# EAGLE design 519_jetson_nano_107 (EAGLE 9.6.0)
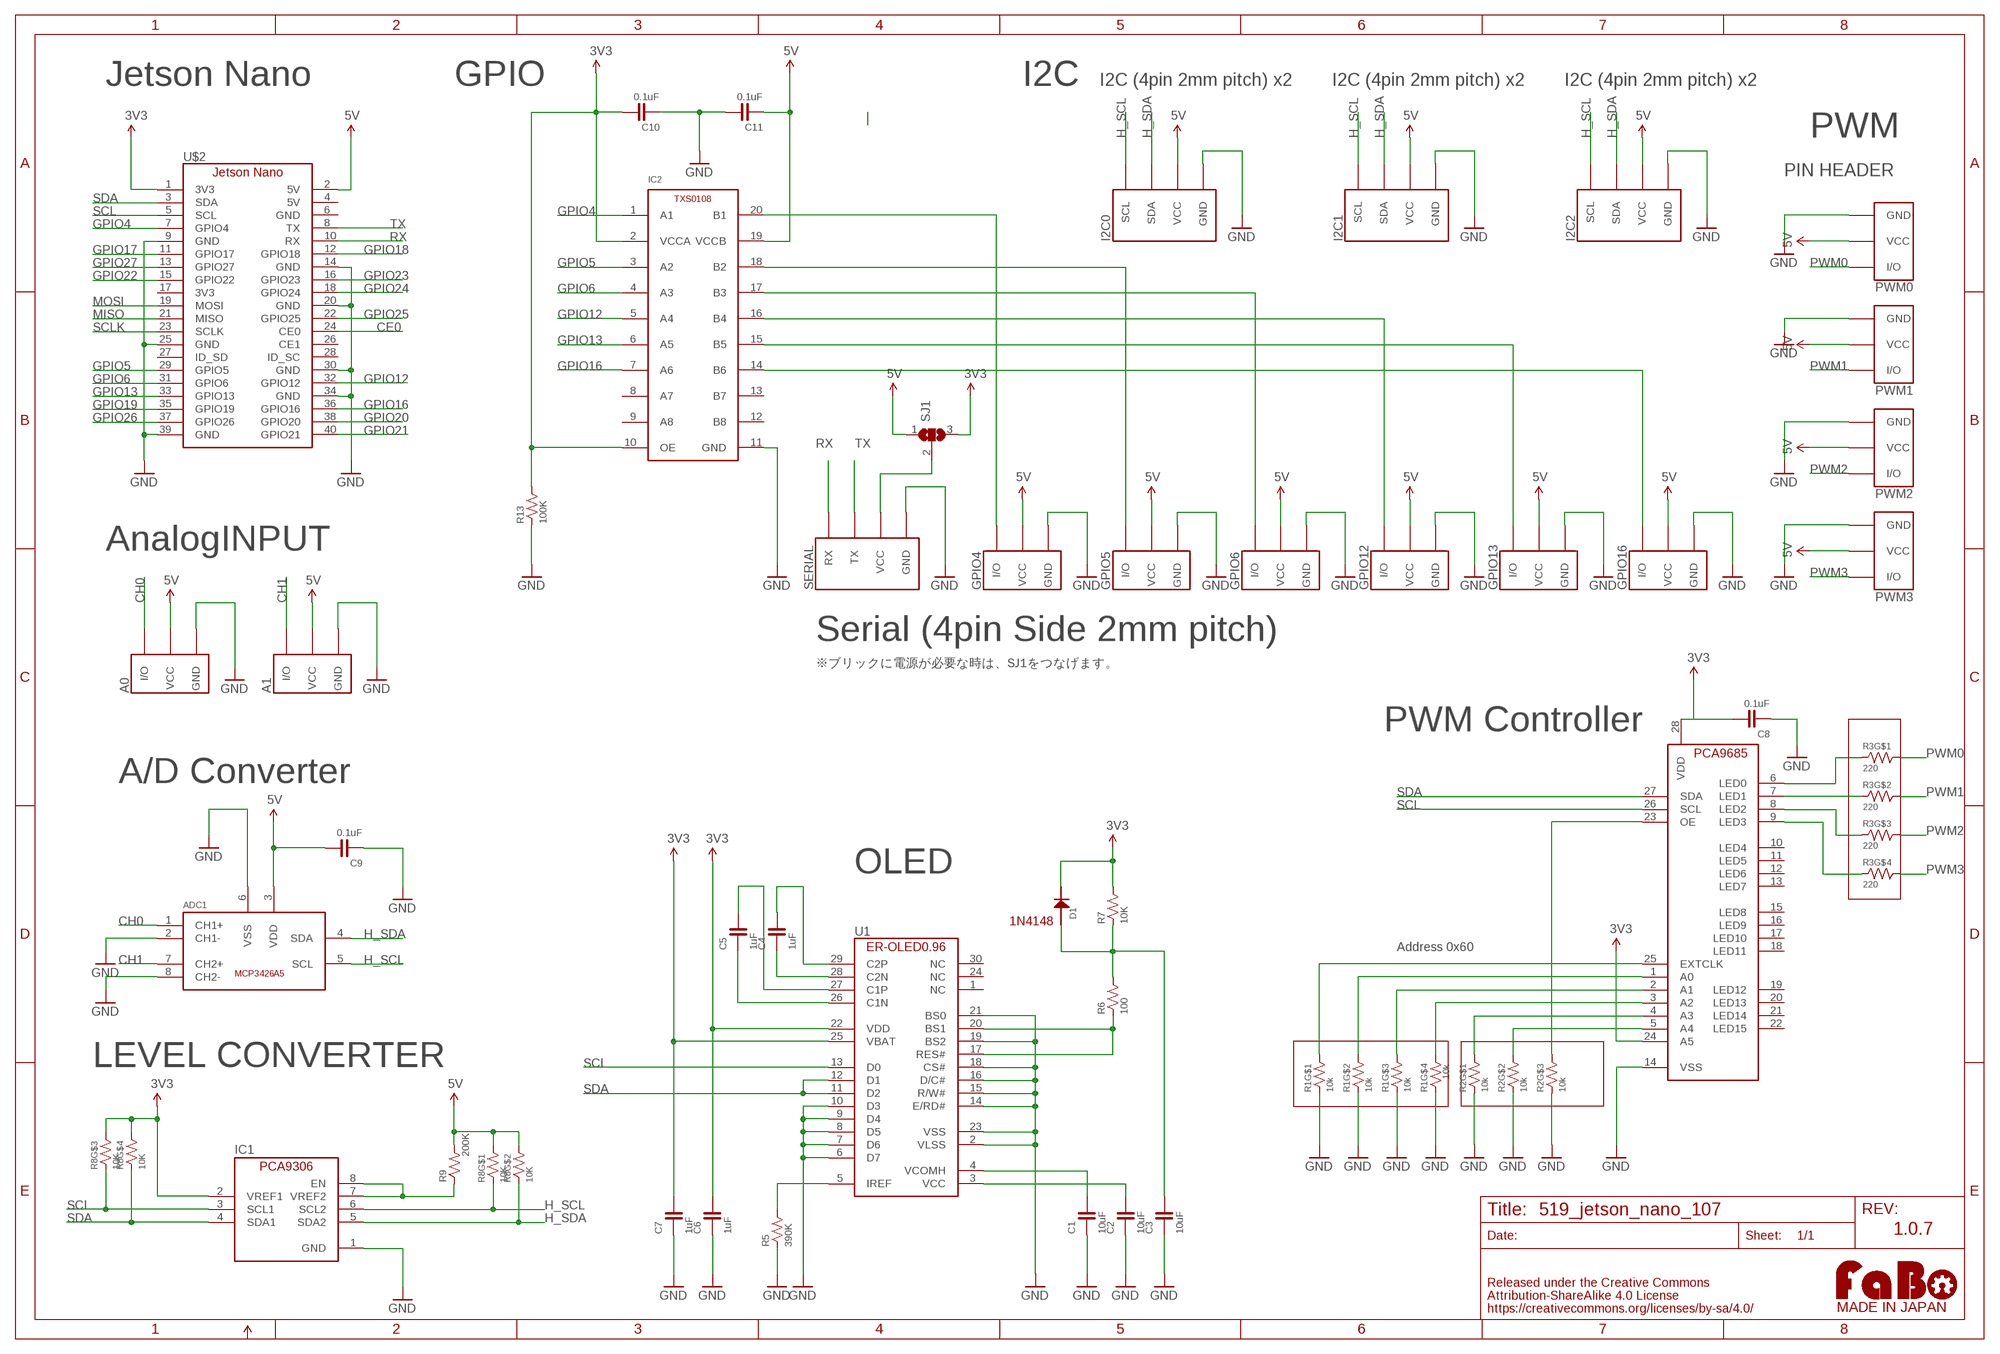
[diagram p0: schematic, sheet 1]

## Parts
A0  FABO_BRICK_3PIN-S03B-PASK-2  [FABO_BRICK_3PIN_S03B-PASK-2]
A1  FABO_BRICK_3PIN-S03B-PASK-2  [FABO_BRICK_3PIN_S03B-PASK-2]
ADC1  MICROCHIP-MCP3426  [MICROCHIP-MCP3426]
C1  10uF  CAPACITOR-0603-BOTTOM  [0603-BOTTOM]
C2  10uF  CAPACITOR-0603-BOTTOM  [0603-BOTTOM]
C3  10uF  CAPACITOR-0603-BOTTOM  [0603-BOTTOM]
C4  1uF  CAPACITOR-0603-BOTTOM  [0603-BOTTOM]
C5  1uF  CAPACITOR-0603-BOTTOM  [0603-BOTTOM]
C6  1uF  CAPACITOR-0603-BOTTOM  [0603-BOTTOM]
C7  1uF  CAPACITOR-0603-BOTTOM  [0603-BOTTOM]
C8  0.1uF  CAPACITOR-0603  [0603]
C9  0.1uF  CAPACITOR-0603  [0603]
C10  0.1uF  CAPACITOR-0603  [0603]
C11  0.1uF  CAPACITOR-0603  [0603]
D1  1N4148  [1N4148W]
GPIO4  FABO_BRICK_3PIN-B03B-PASK-1  [FABO_BRICK_3PIN_B03B-PASK-1]
GPIO5  FABO_BRICK_3PIN-B03B-PASK-1  [FABO_BRICK_3PIN_B03B-PASK-1]
GPIO6  FABO_BRICK_3PIN-B03B-PASK-1  [FABO_BRICK_3PIN_B03B-PASK-1]
GPIO12  FABO_BRICK_3PIN-B03B-PASK-1  [FABO_BRICK_3PIN_B03B-PASK-1]
GPIO13  FABO_BRICK_3PIN-B03B-PASK-1  [FABO_BRICK_3PIN_B03B-PASK-1]
GPIO16  FABO_BRICK_3PIN-B03B-PASK-1  [FABO_BRICK_3PIN_B03B-PASK-1]
I2C0  FABO_BRICK_I2C-S04B-PASK-2  [FABO_BRICK_I2C_S04B-PASK-2]
I2C1  FABO_BRICK_I2C-B04B-PASK-1  [FABO_BRICK_I2C_B04B-PASK-1]
I2C2  FABO_BRICK_I2C-B04B-PASK-1  [FABO_BRICK_I2C_B04B-PASK-1]
IC1  PCA9306_SSOP  [8PIN-SSOP]
IC2  TXS0108  [R-PUSON-N20]
PWM0  FABO_BRICK_3PIN-HEADER  [FABO_BRICK_3PIN_HEADER]
PWM1  FABO_BRICK_3PIN-HEADER  [FABO_BRICK_3PIN_HEADER]
PWM2  FABO_BRICK_3PIN-HEADER  [FABO_BRICK_3PIN_HEADER]
PWM3  FABO_BRICK_3PIN-HEADER  [FABO_BRICK_3PIN_HEADER]
R1  10k  RESISTOR_ARRAY  [EXBV8V]
R2  10k  RESISTOR_ARRAY  [EXBV8V]
R3  220  RESISTOR_ARRAY  [EXBV8V]
R5  390K  RESISTOR-0603-BOTTOM  [0603-BOTTOM]
R6  100  RESISTOR-0603-BOTTOM  [0603-BOTTOM]
R7  10K  RESISTOR-0603-BOTTOM  [0603-BOTTOM]
R8  10K  RESISTOR_ARRAY  [EXBV8V]
R9  200K  RESISTOR-0603  [0603]
R13  100K  RESISTOR-0603-BOTTOM  [0603-BOTTOM]
SERIAL  FABO_BRICK_SERIAL-B04B-PASK-1  [FABO_BRICK_SERIAL_B04B-PASK-1]
SJ1  SJ2W  [SJ_2]
U1  ER-OLED0.96-1ER-CON30HT-1  [ER-CON30HT-1]
U$2  JETSON_NANO_WIDE  [JETSON_NANO_WIDE]
U$9  PCA9685  [PCA9685]
U$14  LOGO_FABO-M  [LOGO_FABO_MS]

## Nets
3V3: C6.2 C7.2 C8.2 C10.2 D1.CATHODE IC1.2(VREF1) IC2.2(VCCA) IC2.10(OE) R7.2 R8.5 R8.6 R13.2 SJ1.3 U1.22(VDD) U1.25(VBAT) U$2.1(3V3) U$9.24(A5) U$9.28(VDD)
5V: A0.VCC A1.VCC ADC1.3(VDD) C9.2 C11.1 GPIO4.VCC GPIO5.VCC GPIO6.VCC GPIO12.VCC GPIO13.VCC GPIO16.VCC I2C0.VCC I2C1.VCC I2C2.VCC IC2.19(VCCB) PWM0.VCC PWM1.VCC PWM2.VCC PWM3.VCC R8.7 R8.8 R9.2 SJ1.1 U$2.2(5V)
CE0: U$2.24(CE0)
CH0: A0.I/O ADC1.1(CH1+)
CH1: A1.I/O ADC1.7(CH2+)
GND: A0.GND A1.GND ADC1.2(CH1-) ADC1.6(VSS) ADC1.8(CH2-) C1.1 C2.1 C3.1 C6.1 C7.1 C8.1 C9.1 C10.1 C11.2 GPIO4.GND GPIO5.GND GPIO6.GND GPIO12.GND GPIO13.GND GPIO16.GND I2C0.GND I2C1.GND I2C2.GND IC1.1(GND) IC2.11(GND) PWM0.GND PWM1.GND PWM2.GND PWM3.GND R1.1 R1.2 R1.3 R1.4 R2.1 R2.2 R2.3 R5.1 R13.1 SERIAL.GND U1.2(VLSS) U1.6(D7) U1.7(D6) U1.8(D5) U1.9(D4) U1.10(D3) U1.14(E/RD#) U1.15(R/W#) U1.16(D/C#) U1.18(CS#) U1.19(BS2) U1.21(BS0) U1.23(VSS) U$2.9(GND) U$2.14(GND) U$2.20(GND) U$2.25(GND) U$2.30(GND) U$2.34(GND) U$2.39(GND) U$9.14(VSS)
GPIO4: IC2.1(A1) U$2.7(GPIO4)
GPIO5: IC2.3(A2) U$2.29(GPIO5)
GPIO6: IC2.4(A3) U$2.31(GPIO6)
GPIO12: IC2.5(A4) U$2.32(GPIO12)
GPIO13: IC2.6(A5) U$2.33(GPIO13)
GPIO16: IC2.7(A6) U$2.36(GPIO16)
GPIO17: U$2.11(GPIO17)
GPIO18: U$2.12(GPIO18)
GPIO19: U$2.35(GPIO19)
GPIO20: U$2.38(GPIO20)
GPIO21: U$2.40(GPIO21)
GPIO22: U$2.15(GPIO22)
GPIO23: U$2.16(GPIO23)
GPIO24: U$2.18(GPIO24)
GPIO25: U$2.22(GPIO25)
GPIO26: U$2.37(GPIO26)
GPIO27: U$2.13(GPIO27)
H_SCL: ADC1.5(SCL) I2C0.SCL I2C1.SCL I2C2.SCL IC1.6(SCL2) R8.1
H_SDA: ADC1.4(SDA) I2C0.SDA I2C1.SDA I2C2.SDA IC1.5(SDA2) R8.2
MISO: U$2.21(MISO)
MOSI: U$2.19(MOSI)
N$2: R3.1 U$9.6(LED0)
N$3: R3.2 U$9.7(LED1)
N$4: R1.7 U$9.1(A0)
N$5: R3.3 U$9.8(LED2)
N$6: R3.4 U$9.9(LED3)
N$7: R2.6 U$9.23(OE)
N$8: R1.8 U$9.25(EXTCLK)
N$9: GPIO4.I/O IC2.20(B1)
N$10: R1.6 U$9.2(A1)
N$11: R1.5 U$9.3(A2)
N$12: R2.8 U$9.4(A3)
N$13: R2.7 U$9.5(A4)
N$14: C5.2 U1.27(C1P)
N$15: GPIO5.I/O IC2.18(B2)
N$16: C5.1 U1.26(C1N)
N$17: GPIO6.I/O IC2.17(B3)
N$18: GPIO12.I/O IC2.16(B4)
N$19: C4.1 U1.28(C2N)
N$20: GPIO13.I/O IC2.15(B5)
N$21: C4.2 U1.29(C2P)
N$22: GPIO16.I/O IC2.14(B6)
N$23: R5.2 U1.5(IREF)
N$24: C1.2 U1.4(VCOMH)
N$25: C2.2 U1.3(VCC)
N$26: R6.1 U1.17(RES#) U1.20(BS1)
N$27: C3.2 D1.ANODE R6.2 R7.1
N$30: SERIAL.VCC SJ1.2
N$33: IC1.7(VREF2) IC1.8(EN) R9.1
PWM0: PWM0.I/O R3.8
PWM1: PWM1.I/O R3.7
PWM2: PWM2.I/O R3.6
PWM3: PWM3.I/O R3.5
RX: SERIAL.RX U$2.10(RX)
SCL: IC1.3(SCL1) R8.3 U1.13(D0) U$2.5(SCL) U$9.26(SCL)
SCLK: U$2.23(SCLK)
SDA: IC1.4(SDA1) R8.4 U1.11(D2) U1.12(D1) U$2.3(SDA) U$9.27(SDA)
TX: SERIAL.TX U$2.8(TX)
Unconnected: IC2.8(A7) IC2.9(A8) IC2.12(B8) IC2.13(B7) R2.4 R2.5 U1.1(NC) U1.24(NC) U1.30(NC) U$2.4(5V) U$2.6(GND) U$2.17(3V3) U$2.26(CE1) U$2.27(ID_SD) U$2.28(ID_SC) U$9.10(LED4) U$9.11(LED5) U$9.12(LED6) U$9.13(LED7) U$9.15(LED8) U$9.16(LED9) U$9.17(LED10) U$9.18(LED11) U$9.19(LED12) U$9.20(LED13) U$9.21(LED14) U$9.22(LED15)

## Notes on the sheet
- Jetson Nano | GPIO | I2C | I2C (4pin 2mm pitch) x2 | I2C (4pin 2mm pitch) x2 | I2C (4pin 2mm pitch) x2
- PWM
- PIN HEADER
- AnalogINPUT
- Serial (4pin Side 2mm pitch)
- ※ブリックに電源が必要な時は、SJ1をつなげます。
- PWM Controller
- A/D Converter
- OLED
- 1N4148
- Address 0x60
- A5
- LEVEL CONVERTER
- 1.0.7

## Library data of the parts
A0 A1 GPIO4-GPIO6 GPIO12 GPIO13 GPIO16 PWM0 PWM1-PWM3 = FaBo-Template:FABO_BRICK_3PIN: FaBo Brick 3pin
ADC1 = FaBo-ADC:MICROCHIP-MCP3426
C1-C11 = FaBo-Capacitor:CAPACITOR: CAPACITOR
D1 = FaBo-Diode:1N4148
I2C0 I2C1 I2C2 = FaBo-Template:FABO_BRICK_I2C: FaBo Brick I2C
IC1 = FaBo-LevelTranslator:PCA9306
IC2 = FaBo-LevelTranslator:TXS0108
R1-R3 R8 = component:RESISTOR_ARRAY
R5-R7 R9 R13 = FaBo-Resistors:RESISTOR: RESISTOR
SERIAL = FaBo-Template:FABO_BRICK_SERIAL: FaBo Brick Serial
SJ1 = jumper:SJ2W: SMD solder JUMPER
U1 = FaBo-Display:ER-OLED0.96-1
U$2 = FaBo-Boards:JETSON_NANO
U$9 = FaBo-Motor:PCA9685
U$14 = FaBo-etc:LOGO_FABO

## Board
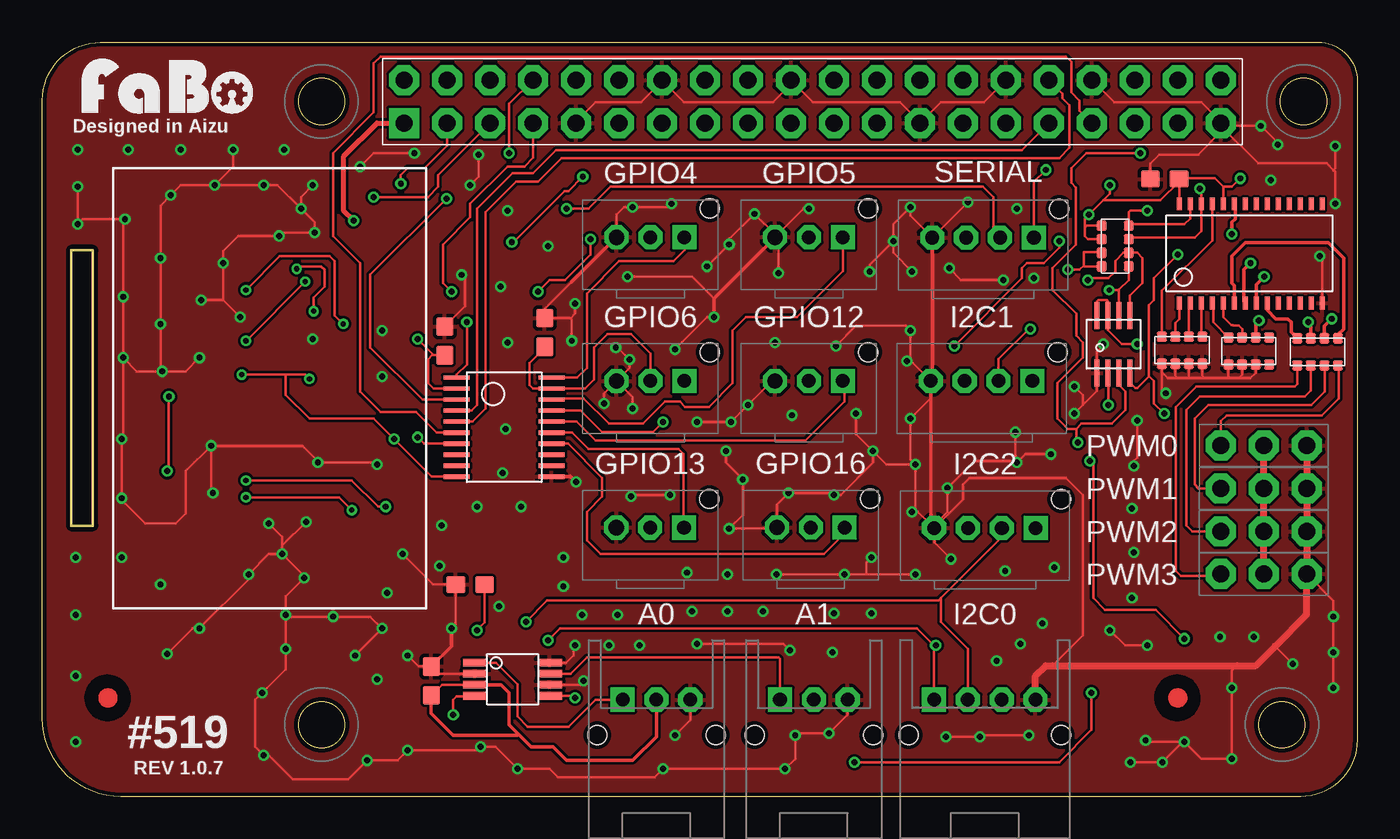
[diagram p1: board, top side]
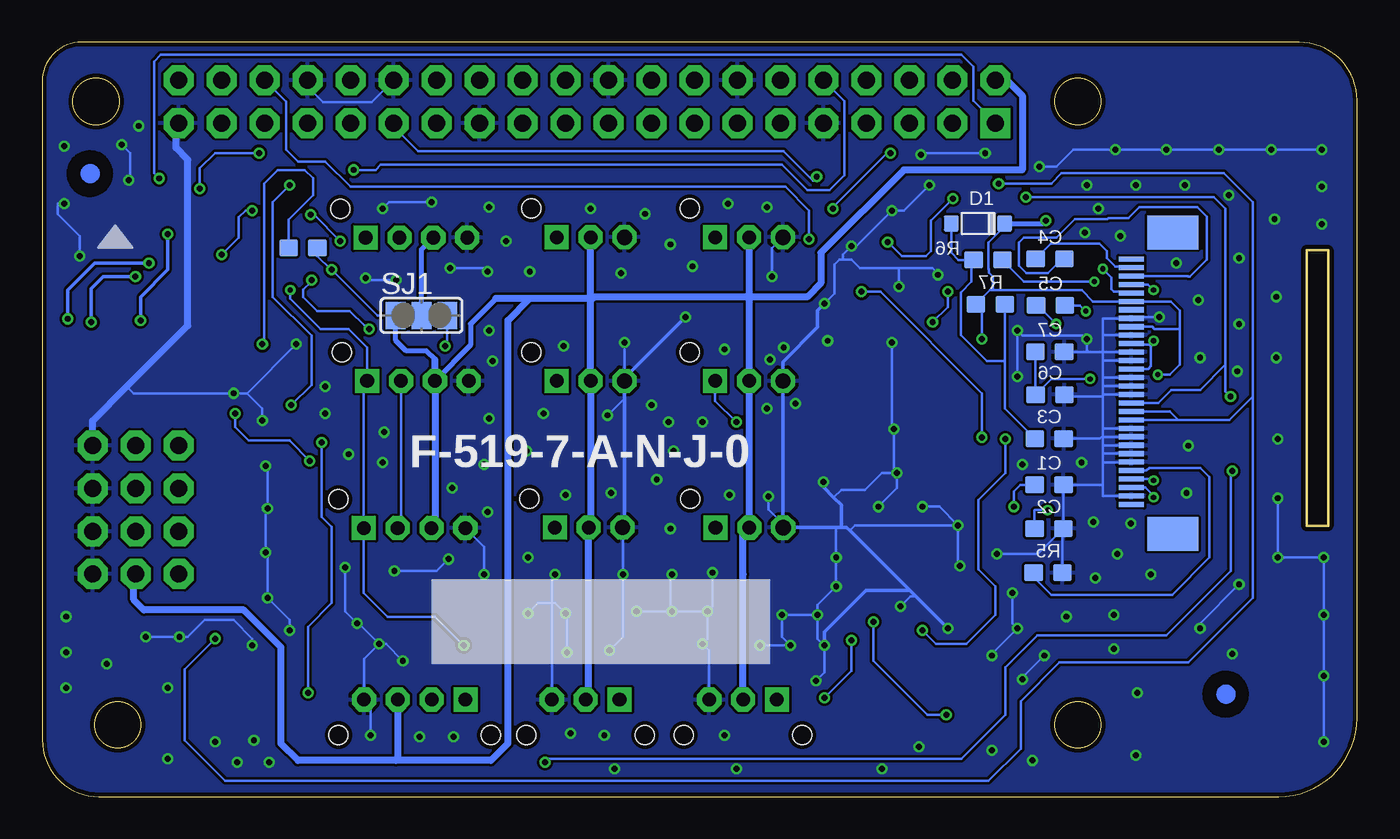
[diagram p2: board, bottom side, seen from below]

Size 74.16 x 39.58 mm. Coordinates in mm from the lower left corner, seen from the top.
Outline: 0,29.42 0,13.13 1.27,13.13 1.27,29.42 0,29.42
Outline: circle at 14.78,38.2 radius 1.38
Outline: circle at 14.78,1.38 radius 1.38
Outline: circle at 71.51,1.38 radius 1.38
Outline: circle at 72.78,38.2 radius 1.38
Copper layers (1*16): Top 0.035mm / dielectric 1.6mm / Bottom 0.035mm
Design rules "PCBway": minimum track width 6mil, minimum drill 12mil, track to track 6mil, track to pad 6mil, pad to pad 6mil, via to via 6mil, smd to smd 6mil, copper to edge 10mil, drill to drill 10mil, minimum pad ring 10mil, minimum via ring 6mil, stop-mask expansion 2mil, vias tented up to drill 100mil, thermal gap 8mil
bRestrict: 7 lines

### Footprints (pad centres in the part's own frame; a part is rotated, then mirrored left to right if it is on the bottom)
FABO_BRICK_3PIN_S03B-PASK-2 = drill 0.8 pad 1.422 octagon: GND -2,0; VCC 0,0 | drill 0.8 pad 1.422 square: I/O 2,0 | hole 1.1: 3.5,2.1; -3.5,2.1
MICROCHIP-MCP3426 = smd 0.45 x 1.45: 1 -0.975,-2.2; 2 -0.325,-2.2; 3 0.325,-2.2; 4 0.975,-2.2; 5 0.975,2.2; 6 0.325,2.2; 7 -0.325,2.2; 8 -0.975,2.2
0603-BOTTOM = smd 1.1 x 1 bottom: 1 -0.85,0; 2 0.85,0
0603 = smd 1.1 x 1: 1 -0.85,0; 2 0.85,0
1N4148W = smd 0.9 x 0.95: ANODE 0,0; CATHODE 3.15,0
FABO_BRICK_3PIN_B03B-PASK-1 = drill 0.9 pad 1.422 octagon: GND -2,0 | drill 0.8 pad 1.422 square: I/O 2,0 | drill 0.8 pad 1.422 octagon: VCC 0,0 | hole 1.1: 3.5,1.7
FABO_BRICK_I2C_S04B-PASK-2 = drill 0.8 pad 1.422 octagon: GND -3,0; SDA 1,0; VCC -1,0 | drill 0.8 pad 1.422 square: SCL 3,0 | hole 1.1: 4.5,2.1; -4.5,2.1
FABO_BRICK_I2C_B04B-PASK-1 = drill 0.8 pad 1.422 octagon: GND -3,0; SDA 1,0; VCC -1,0 | drill 0.8 pad 1.422 square: SCL 3,0 | hole 1.1: 4.5,1.7
8PIN-SSOP = smd 0.3 x 1.6: 1 -0.975,-1.7; 2 -0.325,-1.7; 3 0.325,-1.7; 4 0.975,-1.7; 5 0.975,1.7; 6 0.325,1.7; 7 -0.325,1.7; 8 -0.975,1.7
R-PUSON-N20 = smd 0.25 x 1.55: 1 -2.925,-2.8; 2 -2.275,-2.8; 3 -1.625,-2.8; 4 -0.975,-2.8; 5 -0.325,-2.8; 6 0.325,-2.8; 7 0.975,-2.8; 8 1.625,-2.8; 9 2.275,-2.8; 10 2.925,-2.8; 11 2.925,2.8; 12 2.275,2.8; 13 1.625,2.8; 14 0.975,2.8; 15 0.325,2.8; 16 -0.325,2.8; 17 -0.975,2.8; 18 -1.625,2.8; 19 -2.275,2.8; 20 -2.925,2.8
FABO_BRICK_3PIN_HEADER = drill 1 pad 1.778 octagon: GND -2.54,0; I/O 2.54,0; VCC 0,0
EXBV8V = smd 0.6 x 0.6: 1 -1.2,-0.8; 2 -0.4,-0.8; 3 0.4,-0.8; 4 1.2,-0.8; 5 1.2,0.8; 6 0.4,0.8; 7 -0.4,0.8; 8 -1.2,0.8
FABO_BRICK_SERIAL_B04B-PASK-1 = drill 0.8 pad 1.422 octagon: GND -3,0; TX 1,0; VCC -1,0 | drill 0.8 pad 1.422 square: RX 3,0 | hole 1.1: 4.5,1.7
SJ_2 = smd 1.168 x 1.6: 1 -1.524,0; 2 0,0; 3 1.524,0
ER-CON30HT-1 = smd 0.3 x 1.5 bottom: 1 7,-0.23; 2 6.5,-0.23; 3 6,-0.23; 4 5.5,-0.23; 5 5,-0.23; 6 4.5,-0.23; 7 4,-0.23; 8 3.5,-0.23; 9 3,-0.23; 10 2.5,-0.23; 11 2,-0.23; 12 1.5,-0.23; 13 1,-0.23; 14 0.5,-0.23; 15 0,-0.23; 16 -0.5,-0.23; 17 -1,-0.23; 18 -1.5,-0.23; 19 -2,-0.23; 20 -2.5,-0.23; 21 -3,-0.23; 22 -3.5,-0.23; 23 -4,-0.23; 24 -4.5,-0.23; 25 -5,-0.23; 26 -5.5,-0.23; 27 -6,-0.23; 28 -6.5,-0.23; 29 -7,-0.23; 30 -7.5,-0.23 | smd 2 x 3 bottom: 31 -9.07,-2.67; 32 8.74,-2.67
JETSON_NANO_WIDE = drill 1 pad 1.778 square: 1 21.59,39.37 | drill 1 pad 1.778 octagon: 2 21.59,41.91; 3 24.13,39.37; 4 24.13,41.91; 5 26.67,39.37; 6 26.67,41.91; 7 29.21,39.37; 8 29.21,41.91; 9 31.75,39.37; 10 31.75,41.91; 11 34.29,39.37; 12 34.29,41.91; 13 36.83,39.37; 14 36.83,41.91; 15 39.37,39.37; 16 39.37,41.91; 17 41.91,39.37; 18 41.91,41.91; 19 44.45,39.37; 20 44.45,41.91; 21 46.99,39.37; 22 46.99,41.91; 23 49.53,39.37; 24 49.53,41.91; 25 52.07,39.37; 26 52.07,41.91; 27 54.61,39.37; 28 54.61,41.91; 29 57.15,39.37; 30 57.15,41.91; 31 59.69,39.37; 32 59.69,41.91; 33 62.23,39.37; 34 62.23,41.91; 35 64.77,39.37; 36 64.77,41.91; 37 67.31,39.37; 38 67.31,41.91; 39 69.85,39.37; 40 69.85,41.91
PCA9685 = smd 0.3 x 0.75: 1 -4.15,-2.93; 2 -3.5,-2.93; 3 -2.85,-2.93; 4 -2.2,-2.93; 5 -1.55,-2.93; 6 -0.9,-2.93; 7 -0.25,-2.93; 8 0.4,-2.93; 9 1.05,-2.93; 10 1.7,-2.93; 11 2.35,-2.93; 12 3,-2.93; 13 3.65,-2.93; 14 4.3,-2.93; 15 4.3,2.92; 16 3.65,2.92; 17 3,2.92; 18 2.35,2.92; 19 1.7,2.92; 20 1.05,2.92; 21 0.4,2.92; 22 -0.25,2.92; 23 -0.9,2.92; 24 -1.55,2.92; 25 -2.2,2.92; 26 -2.85,2.92; 27 -3.5,2.92; 28 -4.15,2.92

### Placement (x,y rotation side)
A0  34.56,2.86 180 top
A1  43.86,2.86 180 top
ADC1  26.06,4.06 270 top
C1  16.48,15.55 0 top
C2  16.49,12.97 0 top
C3  16.47,18.29 0 top
C4  16.43,28.91 0 top
C5  16.4,26.16 0 top
C6  16.43,20.89 0 top
C7  16.44,23.42 0 top
C8  64.59,33.63 0 top
C9  21.26,3.97 270 top
C10  22.06,24.07 270 top
C11  27.96,24.57 90 top
D1  22.26,31 0 bottom
GPIO4  34.21,30.18 0 top
GPIO5  43.57,30.18 0 top
GPIO6  34.21,21.7 0 top
GPIO12  43.57,21.7 0 top
GPIO13  34.19,13.03 0 top
GPIO16  43.68,13.04 0 top
I2C0  53.96,2.86 180 top
I2C1  53.77,21.7 0 top
I2C2  53.97,13 0 top
IC1  61.56,23.87 0 top
IC2  25.56,18.96 270 top
PWM0  70.45,17.89 180 top
PWM1  70.44,15.35 180 top
PWM2  70.44,12.8 180 top
PWM3  70.44,10.29 180 top
R1  65.62,23.51 0 top
R2  69.56,23.46 0 top
R3  73.62,23.42 180 top
R5  16.54,10.35 0 top
R6  20.09,28.85 0 top
R7  19.95,26.24 0 top
R8  61.66,29.67 90 top
R9  60.56,29.57 0 bottom
R13  23.56,9.66 180 bottom
SERIAL  53.86,30.17 0 top
SJ1  53.56,25.57 0 bottom
U1  11.85,21.39 270 top
U$2  -1.94,-2.44 0 top
U$3  [MARK_POINT_3MM]  2.16,2.97 0 top
U$4  [MARK_POINT_3MM]  65.36,2.97 0 top
U$5  [MARK_POINT_3MM]  6.03,3.19 0 bottom
U$6  [MARK_POINT_3MM]  73.13,33.95 0 bottom
U$9  69.59,29.23 0 top
U$14  5.68,37.12 0 top

### Tracks (layer width: path | path; a pad name or v marks a point on that pad's centre or on a via)
3V3  (via drill 0.3, 0.35)
  Top 0.152: v14.06,21.82 13.81,22.07 12.66,22.07 | v10.06,22.07 12.66,22.07 | R8.6 60.06,30.07 59.86,30.27 59.86,30.77 | 59.86,30.77 59.96,30.86 R8.5 | 59.86,30.77 59.86,31.27 v60.11,31.52 60.96,32.36 | U$9.28 65.44,33.46 | 65.44,33.46 C8.2 | C8.2 | U$9.24 68.04,33.16 | 68.04,33.16 68.04,33.18 67.56,33.66 65.49,33.66 C8.2 | 65.44,33.46 64.34,32.36 60.96,32.36 | IC1.2 61.26,22.14 v61.26,20.27 | v61.36,33.27 61.36,32.77 60.96,32.36 | v69.06,33.66 68.56,33.16 68.04,33.16 | v20.46,24.17 21.41,23.21 C10.2 21.31,23.21 21.06,22.96 21.06,21.57 21.38,21.24 IC2.2 | R13.2 24.41,7.41 v23.96,6.96 | 12.66,22.07 12.66,20.87 14.06,19.46 17.86,19.46 v19.06,18.27 21.29,16.04 IC2.10 | v52.16,23.77 56.16,27.77 56.16,28.37 56.46,28.67 57.46,28.67 58.36,29.57 v58.36,29.96
  Top 0.305: v16.66,31.17 16.06,31.77 16.06,34.95 18.05,36.93 U$2.1
  Bottom 0.152: 19.81,27.07 14.56,27.07 13.89,26.39 U1.25 9.29,26.39 8.76,25.87 8.76,24.77 | 19.81,27.07 19.81,27.87 20.04,28.09 20.04,28.29 20.06,28.32 20.06,29.86 19.11,30.82 D1.CATHODE | v61.26,20.27 60.06,21.46 60.06,24.37 62.36,26.67 62.36,32.27 v61.36,33.27 | v69.06,33.66 69.36,33.96 69.36,40.56 68.96,40.96 21.66,40.96 20.96,40.27 20.96,38.24 U$2.1 | v10.06,22.07 9.36,22.07 8.76,22.67 8.76,24.77 | 19.81,27.07 19.97,27.07 R7.2 20.46,25.89 v20.46,24.17 | U1.22 10.39,24.89 10.26,24.77 8.76,24.77 | C7.2 C6.2 16.35,21.82 v14.06,21.82 | v23.96,6.96 23.16,6.16 21.36,6.16 19.66,7.87 19.66,9.56 20.66,10.56 20.66,14.67 19.06,16.27 v19.06,18.27 | SJ1.3 52.04,23.89 v52.16,23.77 | v58.36,29.96 59.91,31.52 v60.11,31.52
  Bottom 0.305: D1.CATHODE 16.83,31 v16.66,31.17
5V  (via drill 0.35)
  Top 0.152: R8.7 60.86,29.32 59.81,29.32 59.81,28.52 | ADC1.3 21.88,3.74 C9.2 | R8.8 59.86,28.46 59.81,28.52 | v58.86,28.27 59.56,28.27 59.81,28.52 | C11.1 27.96,23.67 27.06,22.77 27.06,21.46 27.29,21.24 IC2.19 30.33,21.24 30.86,21.77 30.86,23.67 31.66,24.46 33.06,24.46 34.21,23.32 GPIO6.VCC
  Top 0.2: ADC1.3 25.38,3.74 25.86,3.27 25.86,1.36 26.41,0.81 | 26.41,0.81 27.16,0.06 28.46,0.06 29.26,-0.74 33.16,-0.74 34.56,0.67 A0.VCC | C9.2 21.26,2.06 22.56,0.77 26.36,0.77 26.41,0.81
  Top 0.406: PWM3.VCC PWM2.VCC PWM1.VCC PWM0.VCC
  Bottom 0.152: R9.2 59.71,29.07 58.91,28.27 v58.86,28.27 56.16,25.57 SJ1.1 | 34.46,10.37 34.56,10.26
  Bottom 0.305: 49.16,26.57 50.66,25.07 50.66,23.8 I2C1.VCC | 52.77,22.96 53.28,23.46 54.46,23.46 55.08,24.09 SJ1.1
  Bottom 0.406: 55.06,-0.74 49.46,-0.74 48.45,0.27 48.45,25.27 47.16,26.57 | 55.06,-0.74 60.86,-0.74 61.86,0.27 61.86,5.96 64.06,8.16 69.96,8.16 70.56,8.76 70.56,10.16 PWM3.VCC | I2C0.VCC 54.96,-0.64 55.06,-0.74 | A1.VCC 43.68,3.05 GPIO16.VCC 43.57,13.14 GPIO12.VCC 43.57,26.46 | A0.VCC 34.56,10.26 34.56,12.65 GPIO13.VCC 34.19,21.68 GPIO6.VCC 34.21,26.67 | 52.77,22.96 I2C1.VCC 52.77,13.21 I2C2.VCC | GPIO4.VCC 34.21,26.67 | 34.21,26.67 30.76,26.67 29.96,27.46 29.96,29.27 25.06,34.16 18.06,34.16 18.06,38.56 18.97,39.47 U$2.2 | 43.57,26.46 43.57,26.57 | 43.57,26.57 GPIO5.VCC | 34.21,26.67 43.37,26.67 43.57,26.46 | 43.57,26.57 47.16,26.57 | 47.16,26.57 49.16,26.57
CH0
  Top 0.152: ADC1.1 25.08,5.04 26.36,3.77 26.36,1.86 26.96,1.27 29.36,1.27 30.96,2.86 A0.I/O
CH1
  Top 0.152: ADC1.7 29.48,4.39 30.46,5.37 41.76,5.37 41.86,5.27 A1.I/O
GND  (via drill 0.35)
  Top 0.152: ADC1.2 21.68,4.39 C9.1 20.51,4.81 v19.86,5.46 | ADC1.6 30.04,3.74 v30.26,3.97 | v29.76,6.06 29.66,5.96 29.66,5.46 29.23,5.04 ADC1.8 | R2.1 68.36,21.96 68.46,21.87 | 68.46,21.87 68.96,21.87 | 68.96,21.87 69.16,22.07 R2.2 | R2.3 69.96,22.17 69.66,21.87 68.96,21.87 | R1.4 66.82,22.01 66.96,21.87 | 66.96,21.87 68.46,21.87 | 65.36,21.87 64.76,21.87 64.42,22.21 R1.1 64.42,21.21 v64.66,20.96 | 65.36,21.87 65.96,21.87 | 65.96,21.87 66.96,21.87 | R1.3 66.02,21.92 65.96,21.87 | R1.2 65.22,22.01 65.36,21.87 | U$9.14 73.89,28.93 v73.76,29.07 | C8.1 63.73,34.54 64.26,35.06 66.56,35.06 67.91,36.41 67.91,36.77 | v60.96,23.87 60.96,23.77 60.59,23.39 IC1.1 60.59,21.09 59.76,20.27 | 57.96,4.87 59.76,6.66 59.76,14.96 58.76,15.96 53.06,15.96 52.66,15.56 52.66,14.69 I2C2.GND 50.97,12.15 v51.96,11.16 | v32.86,27.87 36.67,27.87 37.96,26.58 | v41.66,10.26 v45.66,10.26 46.96,10.26 | v49.86,10.26 46.96,10.26 | v36.96,6.16 42.06,6.16 v42.46,5.76 | v74.66,32.16 74.66,34.06 74.56,34.16 | 74.56,34.16 74.16,34.56 70.11,34.56 68.03,36.64 | 29.56,27.54 27.96,25.94 C11.2 29.46,25.42 | 29.46,25.42 29.51,25.42 29.76,25.67 v29.76,26.27 | C10.1 23.26,26.12 23.26,27.77 v23.06,27.96 | v22.46,7.06 22.71,7.31 R13.1 21.36,9.66 v19.56,11.46 | 8.96,26.46 v9.96,25.46 | 8.96,26.46 v8.96,28.67 8.96,29.37 9.86,30.27 v12.26,30.27 12.46,30.46 v14.36,30.46 14.36,31.07 v13.56,31.86 | U$2.34 61.6,38.16 66.76,38.16 67.91,37.02 U$2.39 67.91,36.77 | 68.03,36.64 67.91,36.77 | U$2.25 50.16,36.96 | 50.16,36.96 51.36,38.16 53.9,38.16 U$2.30 | 50.16,36.96 48.96,38.16 43.82,38.16 U$2.20 42.51,39.21 41.46,38.16 36.2,38.16 U$2.14 34.89,39.39 33.66,38.16 30.96,38.16 29.81,37.02 U$2.9
  Top 0.152: v31.46,20.37 31.46,20.95 GPIO6.GND | v33.16,20.07 33.16,20.75 GPIO6.GND | GPIO6.GND 32.96,22.45 v32.96,22.96 32.26,23.67 v32.16,23.67 | v29.56,24.07 29.56,25.32 29.46,25.42 | v35.66,23.57 37.56,25.46 v37.96,25.46 | GPIO4.GND 32.21,31.52 32.66,31.96 v33.16,31.96 35.26,31.96 v35.46,32.16 | v37.56,28.46 v38.86,29.77 38.86,30.07 v40.36,31.57 41.55,30.37 41.55,30.17 | v43.56,31.86 43.25,31.86 GPIO5.GND 41.76,30 v41.76,28.07 | v38.66,17.57 38.66,16.87 v39.66,15.87 39.66,13.76 v38.86,12.96 41.61,12.96 GPIO16.GND 41.68,14.38 v42.36,15.06 44.96,15.06 v45.06,14.96 45.46,14.96 47.36,16.87 v47.36,17.57 | GPIO12.GND 41.39,21.7 v39.96,20.27 v38.96,19.27 v36.96,19.27 | v33.06,14.87 33.16,14.96 v35.36,14.96 | v45.16,23.77 46.36,24.96 49.26,24.96 v49.56,24.67 49.56,23.07 v49.36,22.87 49.6,22.87 I2C1.GND 50.77,20.68 v49.56,19.46 49.56,17.07 v49.86,16.77 | v46.36,19.77 46.36,18.57 v47.36,17.57 | v47.36,17.57 48.16,16.77 v49.86,16.77 | v49.86,16.77 49.86,14.17 49.71,14.01 | 49.71,14.01 v49.66,13.96 | 49.71,14.01 49.96,14.01 50.89,13.09 51.76,13.96 v51.76,15.37 53.36,16.96 55.76,16.96 | v55.76,18.67 55.76,16.96 | 55.76,16.96 v55.86,16.87 56.36,17.37 v57.86,17.37 | v63.56,6.06 62.26,6.06 v61.36,6.96 | v62.76,16.67 62.76,16.96 62.96,17.17 v62.96,19.37 | v51.66,0.67 v53.66,0.67 53.76,0.77 v56.56,0.77 | v47.16,28.17 47.16,28.57 v48.56,29.96 | v48.56,29.96 48.56,30.96 v49.56,31.96 49.56,31.46 SERIAL.GND v52.96,32.27 | v49.66,28.17 48.56,29.27 v48.56,29.96 | v55.06,27.67 52.56,27.67 v51.86,28.37 | v12.66,7.87 v12.66,5.87 12.66,4.66 v11.26,3.27 10.86,2.86 10.86,0.06 v11.36,-0.44 11.66,-0.44 13.06,-1.83 16.36,-1.83 v17.46,-0.74 19.26,-0.74 v19.86,-0.14 23.96,-0.14 v24.16,0.06 25.06,0.06 v26.36,-1.24 28.26,-1.24 28.76,-1.74 34.46,-1.74 v34.96,-1.24 v42.16,-1.24 42.76,-0.64 v42.76,0.77 42.86,0.86 v44.76,0.86 45.86,1.97 A1.GND
  Top 0.152: v12.66,7.87 12.66,8.96 13.66,9.96 | 13.66,9.96 v13.76,10.06 | v5.66,5.56 7.16,7.06 v7.56,7.06 10.46,9.96 v10.46,10.26 11.66,11.46 v12.46,11.46 | v12.46,11.46 13.66,10.26 13.66,9.96 | v12.46,11.46 12.46,11.96 v13.86,13.37 | v11.66,13.26 12.46,12.46 v12.46,11.46 | v5.36,22.27 5.26,22.37 v5.26,25.07 v5.26,28.96 5.26,32.06 v5.86,32.66 6.46,33.27 v8.46,33.27 | v8.46,33.27 9.56,34.36 v9.56,35.36 | v8.46,33.27 v11.36,33.27 12.16,33.27 v13.56,31.86 | v13.56,31.86 13.56,32.56 v14.26,33.27 | v5.36,22.27 6.76,22.27 v7.56,23.07 | v5.36,22.27 3.86,22.27 v3.06,23.07 | v3.06,23.07 v3.06,26.67 3.06,31.17 v3.16,31.27 0.66,31.27 v0.36,30.96 v0.36,33.16 | v3.06,23.07 3.06,18.37 v2.96,18.27 v2.96,14.76 2.96,14.67 4.36,13.26 6.16,13.26 6.76,13.87 6.76,16.37 v8.26,17.87 | v8.26,17.87 8.26,15.17 v8.36,15.06 | v8.26,17.87 13.66,17.87 14.56,16.96 v14.56,16.87 17.96,16.87 v18.06,16.77 | v7.66,26.46 8.96,26.46 | v16.76,5.46 v18.36,7.06 17.66,7.76 v15.46,7.76 12.76,7.76 v12.66,7.87 | PWM3.GND 74.56,8.71 v74.56,7.76 v74.56,5.66 v74.56,3.56 | v65.76,0.36 66.76,-0.64 v68.56,-0.64 v68.56,3.56 68.56,4.56 68.86,4.87 | v65.76,0.36 63.56,0.36 v63.46,0.46 | v47.26,11.26 46.96,10.96 46.96,10.26 | v35.66,0.77 36.56,1.66 A0.GND | v62.56,-0.83 v64.46,-0.83 65.66,0.36 v65.76,0.36 | v72.16,4.96 71.11,6.01 | v71.26,35.66 71.26,35.77 v70.26,36.77 68.16,36.77 68.03,36.64 | v24.06,35.06 24.06,33.77 v23.56,33.27 | v17.06,34.36 17.86,35.16 v20.26,35.16 | v74.66,35.56 74.66,34.27 74.56,34.16 | 59.76,20.27 v59.26,19.77 | v59.26,21.37 59.76,20.87 59.76,20.27
  Top 0.2: GPIO4.GND 29.56,27.54 | GPIO5.GND 41.55,30.17 37.96,26.58 v37.96,25.46 | SERIAL.GND 50.86,21.79 I2C1.GND 50.77,13.21 50.89,13.09 I2C2.GND | C9.1 22.46,6.01 v22.46,7.06 | IC2.11 29.43,16.04 29.46,16.07 v29.81,15.71
  Top 0.406: PWM0.GND PWM1.GND PWM2.GND PWM3.GND 72.98,7.88 71.11,6.01 69.96,4.87 68.86,4.87 57.96,4.87 57.56,4.87 56.96,4.27 I2C0.GND
  Bottom 0.152: U1.2 13.3,14.89 13.3,15.56 | U1.6 11.62,16.87 13.3,16.87 | 13.3,15.56 13.3,16.87 | U1.7 13.3,17.39 | 13.3,17.39 13.3,16.87 | U1.8 13.3,17.89 | 13.3,17.89 13.3,17.39 | U1.9 13.3,18.39 | 13.3,18.39 13.3,17.89 | U1.14 13.3,20.89 | 13.3,20.89 13.3,20.77 | 13.3,20.77 13.3,18.87 | 13.3,18.87 13.3,18.46 | 13.3,18.46 13.3,18.39 | U1.15 13.3,21.39 | 13.3,21.39 13.3,20.89 | U1.16 13.3,21.89 | 13.3,21.89 13.3,21.39 | U1.18 13.3,22.89 | 13.3,22.89 13.3,21.89 | U1.19 13.3,23.39 | 13.3,23.39 13.3,22.89 | U1.21 13.3,24.39 | 13.3,24.39 13.3,23.46 | 13.3,23.46 13.3,23.39 | 13.3,24.39 13.3,25.39 U1.23 11.55,25.46 v9.96,25.46 | v30.26,3.97 29.76,4.46 v29.76,6.06 30.16,6.46 v30.16,7.87 30.16,7.96 | 70.96,21.37 70.56,20.96 v64.66,20.96 63.86,20.96 | v60.96,23.87 63.86,20.96 | GPIO4.GND 32.86,29.54 v32.86,27.87 | A1.GND 45.86,8.56 | 45.86,8.56 45.86,10.06 v45.66,10.26 | GPIO16.GND 41.66,13.01 v41.66,10.26 41.66,6.56 v42.46,5.76 | I2C2.GND 49.86,11.89 v49.86,10.26 | A0.GND 36.56,5.76 v36.96,6.16 36.66,6.46 v36.66,8.06 | v73.76,29.07 73.76,30.27 75.06,31.57 75.06,32.16 v74.66,32.16 | 28.66,28.87 28.16,28.87 27.66,28.37 25.36,28.37 | 28.66,28.87 28.86,28.87 29.16,28.57 29.16,26.87 v29.76,26.27 | 25.36,28.37 23.36,28.37 23.06,28.07 v23.06,27.96 | R5.1 15.69,12.92 | 15.69,12.92 C2.1 C1.1 13.31,15.55 13.3,15.56 | v19.56,11.46 17.15,11.46 15.69,12.92 | C7.1 14.16,23.42 | 14.16,23.42 13.35,23.42 13.3,23.46 | C6.1 15.46,20.77 13.3,20.77 | C3.1 13.48,18.29 13.3,18.46 | U1.10 13.27,18.89 13.3,18.87 | U$2.30 56.52,38.16 59.36,38.16 60.29,39.09 U$2.34 | 30.16,7.96 30.16,8.46 v29.06,9.56 v29.06,11.26 29.06,13.04 | v36.36,10.37 36.36,8.37 v36.66,8.06 | v36.66,8.06 v38.76,8.06 38.86,8.06
  Bottom 0.152: 38.86,8.06 v40.86,8.06 | v38.76,10.26 38.86,10.16 38.86,8.06 | v33.56,6.06 v31.76,6.06 32.26,6.56 v32.26,7.87 30.26,7.87 30.16,7.96 | v33.06,14.87 33.06,14.12 32.21,13.26 | v25.46,16.27 26.36,16.27 27.36,15.26 28.76,15.26 29.21,14.81 | v21.86,13.16 21.86,10.87 v21.76,10.76 | v21.86,13.16 27.96,13.16 28.26,12.87 | v25.26,8.37 24.66,8.96 24.36,8.96 | v42.56,19.67 41.57,20.66 41.57,21.67 | v41.56,23.96 41.56,22.17 41.41,22.02 | v51.96,11.16 52.66,10.46 v55.16,10.46 | v69.86,6.56 v67.86,6.56 67.36,6.56 66.36,7.56 64.66,7.56 63.56,6.46 v63.56,6.06 | v61.36,6.96 61.36,7.56 v62.66,8.87 62.66,11.46 v62.76,11.56 62.76,14.06 v62.66,14.17 62.66,16.57 v62.76,16.67 | v62.96,19.37 62.96,20.07 63.86,20.96 | v54.66,5.16 55.66,6.16 v56.06,6.16 | v56.06,6.16 57.26,7.37 v57.36,7.37 58.06,8.06 v58.06,10.66 | v56.06,6.16 56.96,5.27 I2C0.GND 56.56,2.47 v56.56,0.77 | v52.96,32.27 55.46,32.27 v55.86,31.86 | v55.06,27.67 56.76,27.67 v56.86,27.77 | v51.86,28.37 49.86,28.37 v49.66,28.17 | v44.96,5.66 44.96,7.87 v45.06,7.96 45.66,8.56 45.86,8.56 | v47.26,7.96 46.66,8.56 45.86,8.56 | v0.26,0.36 v0.26,4.27 v0.26,7.87 v0.26,11.26 v2.96,11.26 v2.96,14.76 | v5.26,9.66 7.56,7.37 v7.56,7.06 | v0.36,35.36 v3.36,35.36 v6.46,35.36 v9.56,35.36 v12.56,35.36 15.06,35.36 16.06,34.36 v17.06,34.36 | v18.36,21.96 v18.36,24.67 18.06,24.37 14.46,24.37 v14.26,24.17 14.26,23.52 14.16,23.42 | v16.76,5.46 18.06,4.16 v18.06,4.06 | v19.86,5.46 19.86,5.56 v18.36,7.06 18.66,7.37 v18.66,9.16 | v71.26,35.66 70.76,35.16 70.76,33.66 v70.86,33.56 | v74.66,35.56 74.76,35.46 | 28.66,28.87 28.66,29.17 v28.16,29.67 27.86,29.67 v25.76,31.77 25.06,31.77 v23.56,33.27
  Bottom 0.152: v20.26,35.16 23.96,35.16 v24.06,35.06 | v23.96,14.26 22.96,14.26 v21.86,13.16 | v26.56,14.26 25.46,15.37 v25.46,16.27 | v25.46,16.27 25.66,16.46 v25.66,18.87 25.76,18.96 v25.76,23.96 | v25.36,27.27 25.36,28.37
  Bottom 0.2: v29.76,26.27 30.16,25.87 30.16,24.87 32.21,22.82 GPIO6.GND 32.21,13.26 32.21,13.04 | v37.96,25.46 41.41,22.02 41.57,21.86 GPIO12.GND 41.57,21.67 41.57,13.14 GPIO16.GND | 32.21,13.04 GPIO13.GND | v22.46,7.06 24.36,8.96 24.71,9.31 | 24.71,9.31 28.26,12.87 28.44,13.04 28.76,13.04 | 28.76,13.04 29.06,13.04 32.21,13.04 | v29.81,15.71 29.81,15.42 29.21,14.81 28.76,14.37 28.76,13.04 | v29.76,6.06 29.76,6.87 27.31,9.31 24.71,9.31
  Bottom 0.406: PWM0.GND 72.99,19.34 70.96,21.37 67.36,24.96 67.36,34.77 68.06,35.46 68.06,36.78 U$2.39
  pour Bottom: -1.94,-3.71 76.8,-3.71 76.8,42.02 -1.94,42.02
  pour Top: -1.94,-3.71 76.8,-3.71 76.8,42.02 -1.94,42.02
GPIO4  (via drill 0.35)
  Top 0.152: IC2.1 22.76,22.07 23.36,22.67 v23.36,25.17 | v22.46,26.96 21.96,27.46 21.96,29.77 23.56,31.36 23.56,32.16 25.76,34.36 26.76,34.36 27.27,34.88 U$2.7
  Bottom 0.152: v23.36,25.17 22.46,26.07 v22.46,26.96
GPIO5  (via drill 0.35)
  Top 0.152: IC2.3 20.73,20.59 17.66,23.67 17.66,27.96 v22.16,32.46 | v30.21,33.77 29.37,32.92 29.13,32.92 26.12,29.91 v26.02,29.91
  Bottom 0.152: v30.21,33.77 30.43,33.54 32.16,35.27 53.76,35.27 55.21,36.71 U$2.29 | v26.02,29.91 25.17,29.07 23.76,29.07 23.46,29.37 23.46,31.17 v22.16,32.46
GPIO6
  Top 0.152: IC2.4 23.63,19.94 23.96,20.27 23.96,31.86 26.05,33.96 26.79,33.96 27.26,33.96 28.63,35.33 56.15,35.33 U$2.31
GPIO12
  Top 0.152: IC2.5 23.68,19.29 24.46,20.07 24.46,31.67 26.26,33.46 27.56,33.46 28.96,34.86 58.36,34.86 58.96,35.46 58.96,37.98 58.55,38.39 58.55,38.67 U$2.32
GPIO13
  Top 0.152: IC2.6 21.58,18.64 20.36,19.87 18.26,19.87 17.06,21.07 17.06,28.67 15.46,30.27 15.46,35.16 17.86,37.56 17.86,40.46 18.26,40.86 58.76,40.86 59.06,40.56 59.06,38.77 59.56,38.27 59.56,37.66 U$2.33
GPIO16  (via drill 0.35)
  Top 0.152: IC2.7 20.83,17.99 v20.46,18.37 | v27.56,26.96 28.26,27.67 29.16,27.67 30.66,29.17 v30.66,30.07
  Bottom 0.152: v20.46,18.37 20.46,20.96 26.46,26.96 v27.56,26.96 | v30.66,30.07 30.66,31.77 32.06,33.16 57.76,33.16 59.26,34.66 60.86,34.66 61.56,35.36 61.56,38.2 U$2.36
H_SCL  (via drill 0.3, 0.35)
  Top 0.152: v61.31,27.07 61.86,27.07 61.89,27.09 | I2C0.SCL 50.96,5.87 51.06,5.96 51.01,6.01 | 51.01,6.01 v51.06,6.06 | R8.1 62.46,27.67 61.89,27.09 | IC1.6 61.89,27.09 | ADC1.5 29.63,3.09 v29.76,2.97 | v28.16,6.37 28.86,7.06 49.96,7.06 51.01,6.01
  Bottom 0.152: v51.06,6.06 52.76,7.76 55.56,7.76 56.97,9.17 I2C2.SCL 56.97,21.5 I2C1.SCL 56.76,23.67 57.86,24.77 59.51,24.77 61.31,26.57 v61.31,27.07 | v29.76,2.97 28.16,4.56 v28.16,6.37
H_SDA  (via drill 0.35)
  Top 0.152: IC1.5 62.53,26.74 63.26,27.46 63.26,28.96 62.96,29.27 R8.2 62.16,29.27 61.66,28.77 61.66,28.17 61.26,27.77 60.16,27.77 v60.06,27.67 | I2C1.SDA 54.77,22.98 56.56,24.77 v56.66,24.77 | ADC1.4 23.83,3.06 22.76,3.06 22.56,2.86 v22.56,1.97 | I2C2.SDA 54.97,12.47 51.36,8.87 | 51.36,8.87 51.36,7.46 52.96,5.87 I2C0.SDA | 51.36,8.87 51.21,8.71 28.11,8.71 v26.86,7.46
  Bottom 0.152: I2C1.SDA 54.77,13.21 I2C2.SDA | v60.06,27.67 60.06,27.57 60.54,27.09 60.54,26.64 59.73,25.83 57.8,25.83 56.93,24.96 56.86,24.96 v56.66,24.77 | v22.56,1.97 23.66,1.97 26.86,5.16 v26.86,7.46
N$2
  Top 0.2: U$9.6 68.69,27.33 68.56,27.46 68.56,29.07 69.36,29.86 74.26,29.86 75.16,28.96 75.16,24.77 74.82,24.43 R3.1
N$3  (via drill 0.35)
  Top 0.2: R3.2 74.02,24.93 v74.46,25.37 | v69.66,28.67 69.26,28.27 69.26,26.38 U$9.7
  Bottom 0.2: v74.46,25.37 74.46,27.07 72.86,28.67 v69.66,28.67
N$4
  Top 0.152: U$9.1 65.44,25.35 65.22,25.12 R1.7
N$5  (via drill 0.35)
  Top 0.2: v73.06,25.17 73.22,25.01 R3.3 | v70.46,27.87 69.99,27.4 U$9.8
  Bottom 0.2: v73.06,25.17 73.06,27.17 72.36,27.87 v70.46,27.87
N$6
  Top 0.2: U$9.9 70.64,25.88 71.16,25.37 71.86,25.37 72.06,25.17 72.06,24.58 R3.4
N$7  (via drill 0.35)
  Top 0.2: R2.6 69.96,25.07 v70.16,25.27 | v68.56,30.36 68.56,31.07 68.76,31.27 68.76,32.08 U$9.23
  Bottom 0.2: v70.16,25.27 70.16,26.67 68.56,28.27 v68.56,30.36
N$8
  Top 0.152: R1.8 64.42,27.02 67.39,30 U$9.25
N$9
  Top 0.152: IC2.20 29.88,21.89 30.46,22.46 30.46,26.87 32.36,28.77 35.56,28.77 36.21,29.42 GPIO4.I/O
N$10
  Top 0.152: R1.6 66.02,26.22 U$9.2
N$11
  Top 0.152: U$9.3 66.74,24.38 R1.5
N$12
  Top 0.152: U$9.4 67.46,26.23 67.46,25.17 R2.8
N$13
  Top 0.152: U$9.5 68.06,26.28 68.06,25.46 68.53,24.99 68.6,24.99 68.63,24.96 68.96,24.96 69.16,24.77 R2.7
N$14  (via drill 0.3)
  Top 0.152: v10.31,27.07 12.31,29.07 15.26,29.07 15.56,28.77 15.56,25.57 v16.06,25.07
  Bottom 0.152: U1.27 10.64,27.39 v10.31,27.07 | v16.06,25.07 17.15,26.16 C5.2
N$15
  Top 0.152: GPIO5.I/O 45.57,28.18 42.86,25.46 39.86,25.46 39.06,24.67 39.06,21.57 37.66,20.17 36.26,20.17 35.96,20.46 35.06,20.46 33.76,19.17 31.76,19.17 30.26,20.67 28.43,20.67 IC2.18
N$16  (via drill 0.3)
  Top 0.152: v14.31,25.82 14.31,26.62 14.96,27.27 14.96,28.27 14.76,28.46 13.46,28.46 v13.31,28.32
  Bottom 0.152: v13.31,28.32 12.81,27.82 12.81,27.12 12.66,26.96 11.69,26.96 U1.26 | v14.31,25.82 14.65,26.16 C5.1
N$17  (via drill 0.35)
  Top 0.152: v34.96,19.27 34.36,18.67 31.36,18.67 30.08,19.94 IC2.17
  Bottom 0.152: v34.96,19.27 36.21,20.52 GPIO6.I/O
N$18
  Top 0.152: IC2.16 29.83,19.29 30.96,18.17 43.36,18.17 45.66,20.46 45.66,21.61 GPIO12.I/O
N$19
  Bottom 0.152: U1.28 8.29,27.89 8.26,27.87 8.16,27.87 7.16,28.87 7.16,31.42 7.71,31.96 11.16,31.96 11.8,31.32 12.99,31.32 13.05,31.27 14.96,31.27 16.06,30.17 17.96,30.17 18.26,29.86 18.26,28.52 17.81,28.07 16.56,28.07 15.72,28.91 C4.1
N$20
  Top 0.152: IC2.15 29.58,18.64 30.56,17.67 35.86,17.67 36.16,17.37 36.16,13.05 GPIO13.I/O
N$21
  Bottom 0.152: C4.2 16.37,29.82 13.51,29.82 13.06,29.37 13.06,28.96 12.56,28.46 11.69,28.46 U1.29
N$22
  Top 0.152: IC2.14 29.33,17.99 31.36,15.96 31.36,14.87 30.46,13.96 30.46,12.26 31.26,11.46 44.46,11.46 45.68,12.68 GPIO16.I/O
N$23
  Bottom 0.152: R5.2 17.39,10.09 16.36,9.06 9.21,9.06 7.01,11.26 7.01,16.02 7.56,16.57 10.56,16.57 10.73,16.39 U1.5
N$24  (via drill 0.3, 0.35)
  Top 0.152: v10.31,15.81 16.56,15.81 18.11,14.26 v18.56,14.26
  Bottom 0.152: v18.56,14.26 18.56,15.17 18.17,15.55 C1.2 | U1.4 10.39,15.89 v10.31,15.81
N$25  (via drill 0.3)
  Top 0.152: v16.56,14.06 15.81,14.81 v10.31,14.81
  Bottom 0.152: v16.56,14.06 17.31,14.06 17.34,14.03 C2.2 | U1.3 10.79,15.39 10.31,14.92 v10.31,14.81
N$26  (via drill 0.3)
  Top 0.152: v10.31,24.07 v13.81,27.57
  Bottom 0.152: 10.54,23.84 v10.31,24.07 | U1.20 11.57,23.84 10.54,23.84 | R6.1 17.96,27.57 v13.81,27.57 | U1.17 10.63,22.39 10.46,22.57 10.46,23.77 10.54,23.84
N$27
  Bottom 0.152: R7.1 19.1,22.87 | 19.1,22.87 19.1,20.07 C3.2 | D1.ANODE 22.26,29.27 21.84,28.85 R6.2 21.06,28.73 21.06,27.57 21.7,26.92 21.7,24.41 20.16,22.87 19.1,22.87
N$30
  Bottom 0.305: SJ1.2 53.56,29.46 SERIAL.VCC
N$33  (via drill 0.35)
  Top 0.152: v62.96,23.87 62.06,23.87 61.23,24.69 IC1.7 61.23,26.39 61.16,26.46 60.66,26.46 60.59,26.39 IC1.8
  Bottom 0.152: R9.1 61.41,31.21 59.96,32.66 59.96,33.66 60.46,34.16 62.06,34.16 62.86,33.36 62.86,23.96 v62.96,23.87
PWM0
  Top 0.152: PWM0.I/O 67.91,19.32 68.26,19.67 73.86,19.67 74.86,20.67 74.86,22.58 R3.8
PWM1
  Top 0.152: PWM1.I/O 66.58,15.35 66.36,15.56 66.36,19.46 67.16,20.27 73.26,20.27 74.06,21.07 74.06,22.58 R3.7
PWM2
  Top 0.152: PWM2.I/O 66.22,12.8 65.86,13.16 65.86,19.96 66.66,20.77 72.86,20.77 73.22,21.12 R3.6
PWM3
  Top 0.152: R3.5 72.42,21.53 72.26,21.37 66.46,21.37 65.26,20.17 65.26,10.46 65.54,10.18 67.8,10.18 PWM3.I/O
RX  (via drill 0.35)
  Top 0.152: SERIAL.RX 56.86,33.46 v57.56,34.16
  Bottom 0.152: U$2.10 28.56,38.22 28.56,33.86 29.46,32.96 30.76,32.96 32.26,34.46 55.96,34.46 56.26,34.16 v57.56,34.16
SCL  (via drill 0.35)
  Top 0.152: R8.3 62.56,30.17 66.36,30.17 66.74,30.55 U$9.26 66.74,32.98 v66.66,33.06 | IC1.3 61.89,21.44 62.26,21.07 62.26,19.96 61.46,19.17 59.66,19.17 59.36,18.87 | v5.76,20.77 5.76,16.46 v5.66,16.37 | v46.26,-0.83 58.36,-0.83 60.26,1.06 v60.26,3.27 | v59.46,18.07 59.36,18.17 59.36,18.87 | v63.16,35.16 59.96,35.16 59.06,34.27 59.06,33.41 59.34,33.13 59.34,29.75 57.96,28.37 57.96,27.07 59.36,25.67 59.36,24.37 59.76,23.96 59.76,23.07 58.26,21.57 58.26,19.46 58.86,18.87 59.36,18.87 | v17.86,32.56 21.06,32.56 21.66,33.16 21.66,33.86 U$2.5
  Bottom 0.152: v17.86,32.56 6.76,32.56 6.06,31.86 6.06,22.67 | 6.06,22.67 6.06,21.07 v5.76,20.77 | v5.66,16.37 5.76,16.27 5.76,10.46 9.56,6.66 17.16,6.66 19.06,4.77 19.06,1.97 21.66,-0.64 46.06,-0.64 v46.26,-0.83 | v60.26,3.27 60.26,7.16 58.86,8.56 58.86,13.06 59.46,13.67 v59.46,18.07 | v63.16,35.16 65.76,35.16 66.66,34.27 v66.66,33.06 | U1.13 10.03,20.39 9.26,21.17 7.56,21.17 6.06,22.67
SDA  (via drill 0.35)
  Top 0.152: U$9.27 66.09,31.3 65.76,30.96 62.56,30.96 R8.4 62.46,31.67 62.56,31.77 v63.56,31.77 | v65.76,6.46 64.06,8.16 61.06,8.16 60.36,8.87 60.36,16.77 v60.16,16.96 | v64.56,19.77 63.96,20.37 63.96,21.7 63.66,22 | 63.66,22 63.66,26.17 63.96,26.46 63.96,27.77 v65.36,29.17 | 63.66,22 63.66,21.96 62.96,21.27 62.86,21.27 62.53,21.59 IC1.4 | U$2.3 22.19,35.59 20.86,34.27 19.86,34.27 19.46,33.86 v19.46,33.36
  Bottom 0.152: 4.46,20.77 4.46,32.27 6.16,33.96 15.76,33.96 16.36,33.36 v19.46,33.36 | 8.86,19.39 5.83,19.39 4.46,20.77 | 8.86,19.39 U1.11 | U1.12 9.36,19.89 8.86,19.39 | 4.46,20.77 4.46,8.87 8.26,5.06 15.86,5.06 18.16,2.77 18.16,-0.04 20.06,-1.94 65.16,-1.94 67.56,0.46 67.56,4.66 v65.76,6.46 | v60.16,16.96 61.36,18.17 63.76,18.17 64.56,18.96 v64.56,19.77 | v65.36,29.17 64.36,30.17 64.36,31.36 63.96,31.77 v63.56,31.77
TX  (via drill 0.35)
  Top 0.152: v25.86,35.16 25.86,38.06 U$2.8 | v29.26,31.86 30.56,31.86 31.86,33.16 53.86,33.16 54.46,32.56 54.46,30.57 SERIAL.TX
  Bottom 0.152: v25.86,35.16 26.06,35.16 29.26,31.96 v29.26,31.86

### Text on the board
tPlace: Designed in Aizu | #519 | REV 1.0.7
bPlace: F-519-7-A-N-J-0